# EAGLE design knob_spi (EAGLE 5.10)
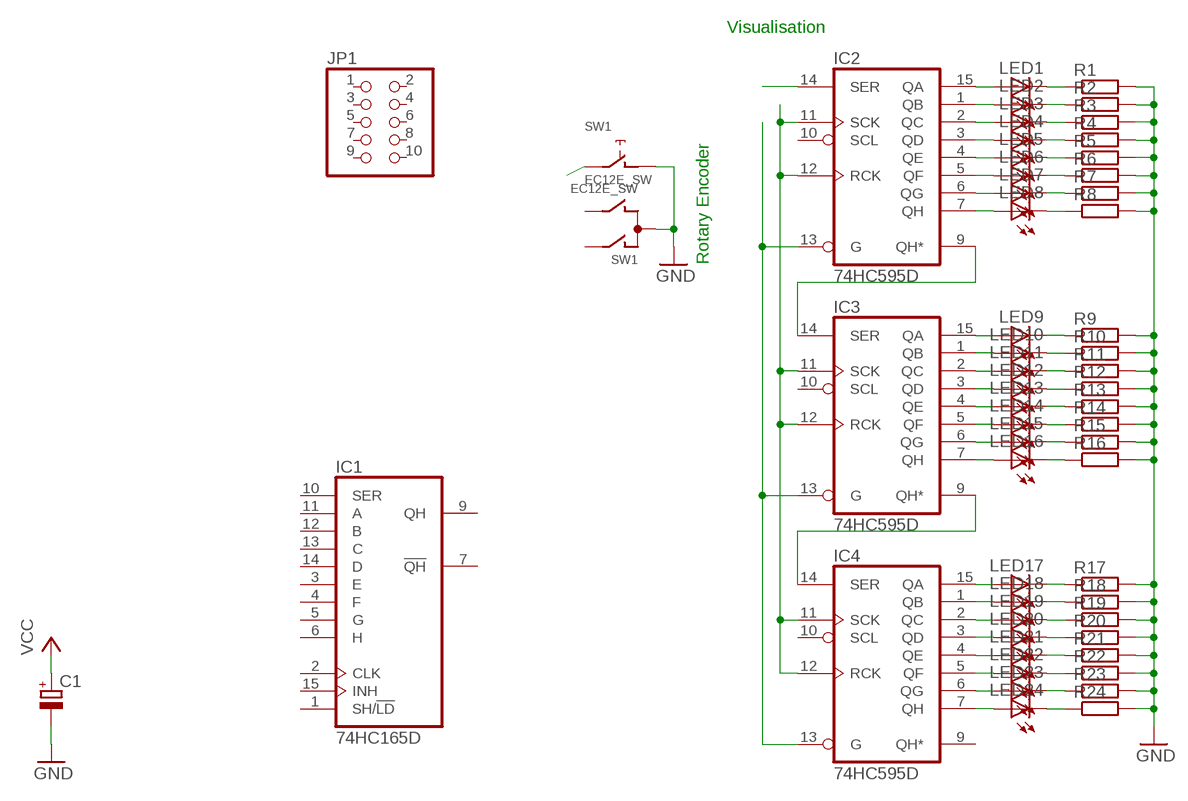
[diagram p0: schematic, sheet 1]

## Parts
C1  CPOL-EUE2.5-5  [E2,5-5]
IC1  74HC165D  [SO16]
IC2  74HC595D  [SO16]
IC3  74HC595D  [SO16]
IC4  74HC595D  [SO16]
JP1  PINHD-2X5  [2X05]
LED1  LED3MM  [LED3MM]
LED2  LED3MM  [LED3MM]
LED3  LED3MM  [LED3MM]
LED4  LED3MM  [LED3MM]
LED5  LED3MM  [LED3MM]
LED6  LED3MM  [LED3MM]
LED7  LED3MM  [LED3MM]
LED8  LED3MM  [LED3MM]
LED9  LED3MM  [LED3MM]
LED10  LED3MM  [LED3MM]
LED11  LED3MM  [LED3MM]
LED12  LED3MM  [LED3MM]
LED13  LED3MM  [LED3MM]
LED14  LED3MM  [LED3MM]
LED15  LED3MM  [LED3MM]
LED16  LED3MM  [LED3MM]
LED17  LED3MM  [LED3MM]
LED18  LED3MM  [LED3MM]
LED19  LED3MM  [LED3MM]
LED20  LED3MM  [LED3MM]
LED21  LED3MM  [LED3MM]
LED22  LED3MM  [LED3MM]
LED23  LED3MM  [LED3MM]
LED24  LED3MM  [LED3MM]
R1  R-EU_M0805  [M0805]
R2  R-EU_M0805  [M0805]
R3  R-EU_M0805  [M0805]
R4  R-EU_M0805  [M0805]
R5  R-EU_M0805  [M0805]
R6  R-EU_M0805  [M0805]
R7  R-EU_M0805  [M0805]
R8  R-EU_M0805  [M0805]
R9  R-EU_M0805  [M0805]
R10  R-EU_M0805  [M0805]
R11  R-EU_M0805  [M0805]
R12  R-EU_M0805  [M0805]
R13  R-EU_M0805  [M0805]
R14  R-EU_M0805  [M0805]
R15  R-EU_M0805  [M0805]
R16  R-EU_M0805  [M0805]
R17  R-EU_M0805  [M0805]
R18  R-EU_M0805  [M0805]
R19  R-EU_M0805  [M0805]
R20  R-EU_M0805  [M0805]
R21  R-EU_M0805  [M0805]
R22  R-EU_M0805  [M0805]
R23  R-EU_M0805  [M0805]
R24  R-EU_M0805  [M0805]
SW1  EC12E_SW  [ALPS_EC12E_SW]

## Nets
GND: C1.- R1.2 R2.2 R3.2 R4.2 R5.2 R6.2 R7.2 R8.2 R9.2 R10.2 R11.2 R12.2 R13.2 R14.2 R15.2 R16.2 R17.2 R18.2 R19.2 R20.2 R21.2 R22.2 R23.2 R24.2 SW1.C SW1.D
N$1: IC2.15(QA) LED1.A
N$2: IC2.1(QB) LED2.A
N$3: IC2.2(QC) LED3.A
N$4: IC2.3(QD) LED4.A
N$5: IC2.4(QE) LED5.A
N$6: IC2.5(QF) LED6.A
N$7: IC2.6(QG) LED7.A
N$8: IC2.9(QH*) IC3.14(SER)
N$9: IC3.15(QA) LED9.A
N$10: IC3.1(QB) LED10.A
N$11: IC3.2(QC) LED11.A
N$12: IC3.3(QD) LED12.A
N$13: IC3.4(QE) LED13.A
N$14: IC3.5(QF) LED14.A
N$15: IC3.6(QG) LED15.A
N$16: IC3.9(QH*) IC4.14(SER)
N$17: IC4.15(QA) LED17.A
N$18: IC4.1(QB) LED18.A
N$19: IC4.2(QC) LED19.A
N$20: IC4.3(QD) LED20.A
N$21: IC4.4(QE) LED21.A
N$22: IC4.5(QF) LED22.A
N$23: IC4.6(QG) LED23.A
N$24: IC4.7(QH) LED24.A
N$25: LED24.K(C) R24.1
N$26: LED23.K(C) R23.1
N$27: LED22.K(C) R22.1
N$28: LED21.K(C) R21.1
N$29: LED20.K(C) R20.1
N$30: LED19.K(C) R19.1
N$31: LED18.K(C) R18.1
N$32: LED17.K(C) R17.1
N$33: LED16.K(C) R16.1
N$34: LED15.K(C) R15.1
N$35: LED14.K(C) R14.1
N$36: LED13.K(C) R13.1
N$37: LED12.K(C) R12.1
N$38: LED11.K(C) R11.1
N$39: LED10.K(C) R10.1
N$40: LED9.K(C) R9.1
N$41: LED8.K(C) R8.1
N$42: LED7.K(C) R7.1
N$43: LED6.K(C) R6.1
N$44: LED5.K(C) R5.1
N$45: LED4.K(C) R4.1
N$46: LED3.K(C) R3.1
N$47: LED2.K(C) R2.1
N$48: LED1.K(C) R1.1
N$49: IC2.13(G) IC3.13(G) IC4.13(G)
N$50: IC2.14(SER)
N$51: IC2.7(QH) LED8.A
N$52: IC2.11(SCK) IC2.12(RCK) IC3.11(SCK) IC3.12(RCK) IC4.11(SCK) IC4.12(RCK)
N$53: SW1.E
N$56: IC3.7(QH) LED16.A
VCC: C1.+
Unconnected: IC1.1(SH/!LD) IC1.2(CLK) IC1.3(E) IC1.4(F) IC1.5(G) IC1.6(H) IC1.7(!QH) IC1.9(QH) IC1.10(SER) IC1.11(A) IC1.12(B) IC1.13(C) IC1.14(D) IC1.15(INH) IC2.10(SCL) IC3.10(SCL) IC4.9(QH*) IC4.10(SCL) JP1.1 JP1.2 JP1.3 JP1.4 JP1.5 JP1.6 JP1.7 JP1.8 JP1.9 JP1.10 SW1.A SW1.B SW1.GND1(G) SW1.GND2(G)

## Notes on the sheet
- Visualisation
- Rotary Encoder

## Power pins joined to a net without a drawn wire
GND: IC1.8(GND) IC2.8(GND) IC3.8(GND) IC4.8(GND)
VCC: IC1.16(VCC) IC2.16(VCC) IC3.16(VCC) IC4.16(VCC)

## Library data of the parts
C1 = resistor:CPOL-EU: POLARIZED CAPACITOR, European symbol
IC1 = 74xx-eu:74*165: 8-bit parallel load SHIFT REGISTER
IC2-IC4 = 74xx-eu:74*595: 8-bit SHIFT REGISTER, output latch
JP1 = pinhead:PINHD-2X5: PIN HEADER
LED1-LED24 = led:LED: LED OSRAM: - CHIPLED LG R971, LG N971, LY N971, LG Q971, LY Q971, LO R971, LY R971 LH N974, LH R974 LS Q976, LO Q976, LY Q976 LO Q996 - Hyper CHIPLED LW Q18S LB Q993, LB Q99A, LB R99A - SideLED LS A670, LO A670, LY A670, LG A670, LP A670 LB A673, LV A673, LT A673, LW A673 LH A674 LY A675 LS A676, LA A676, LO A676, LY A676, LW A676 LS A679, LY A679, LG A679 - Hyper Micro SIDELED® LS Y876, LA Y876, LO Y876, LY Y876 LT Y87S - SmartLED LW L88C, LW L88S LB L89C, LB L89S, LG L890 LS L89K, LO L89K, LY L89K LS L896, LA L896, LO L896, LY L896 - TOPLED LS T670, LO T670, LY T670, LG T670, LP T670 LSG T670, LSP T670, LSY T670, LOP T670, LYG T670 LG T671, LOG T671, LSG T671 LB T673, LV T673, LT T673, LW T673 LH T674 LS T676, LA T676, LO T676, LY T676, LB T676, LH T676, LSB T676, LW T676 LB T67C, LV T67C, LT T67C, LS T67K, LO T67K, LY T67K, LW E67C LS E67B, LA E67B, LO E67B, LY E67B, LB E67C, LV E67C, LT E67C LW T67C LS T679, LY T679, LG T679 LS T770, LO T770, LY T770, LG T770, LP T770 LB T773, LV T773, LT T773, LW T773 LH T774 LS E675, LA E675, LY E675, LS T675 LS T776, LA T776, LO T776, LY T776, LB T776 LHGB T686 LT T68C, LB T68C - Hyper Mini TOPLED® LB M676 - Mini TOPLED Santana® LG M470 LS M47K, LO M47K, LY M47K Source: http://www.osram.convergy.de LUXEON: - LUMILED® LXK2-PW12-R00, LXK2-PW12-S00, LXK2-PW14-U00, LXK2-PW14-V00 LXK2-PM12-R00, LXK2-PM12-S00, LXK2-PM14-U00 LXK2-PE12-Q00, LXK2-PE12-R00, LXK2-PE12-S00, LXK2-PE14-T00, LXK2-PE14-U00 LXK2-PB12-K00, LXK2-PB12-L00, LXK2-PB12-M00, LXK2-PB14-N00, LXK2-PB14-P00, LXK2-PB14-Q00 LXK2-PR12-L00, LXK2-PR12-M00, LXK2-PR14-Q00, LXK2-PR14-R00 LXK2-PD12-Q00, LXK2-PD12-R00, LXK2-PD12-S00 LXK2-PH12-R00, LXK2-PH12-S00 LXK2-PL12-P00, LXK2-PL12-Q00, LXK2-PL12-R00 Source: www.luxeon.com KINGBRIGHT: KA-3528ASYC Source: www.kingbright.com
R1-R24 = resistor:R-EU_: RESISTOR, European symbol
SW1 = switch-alps:EC12E_SW: ALPS rotary Encoder EC12E series with switch

## Board
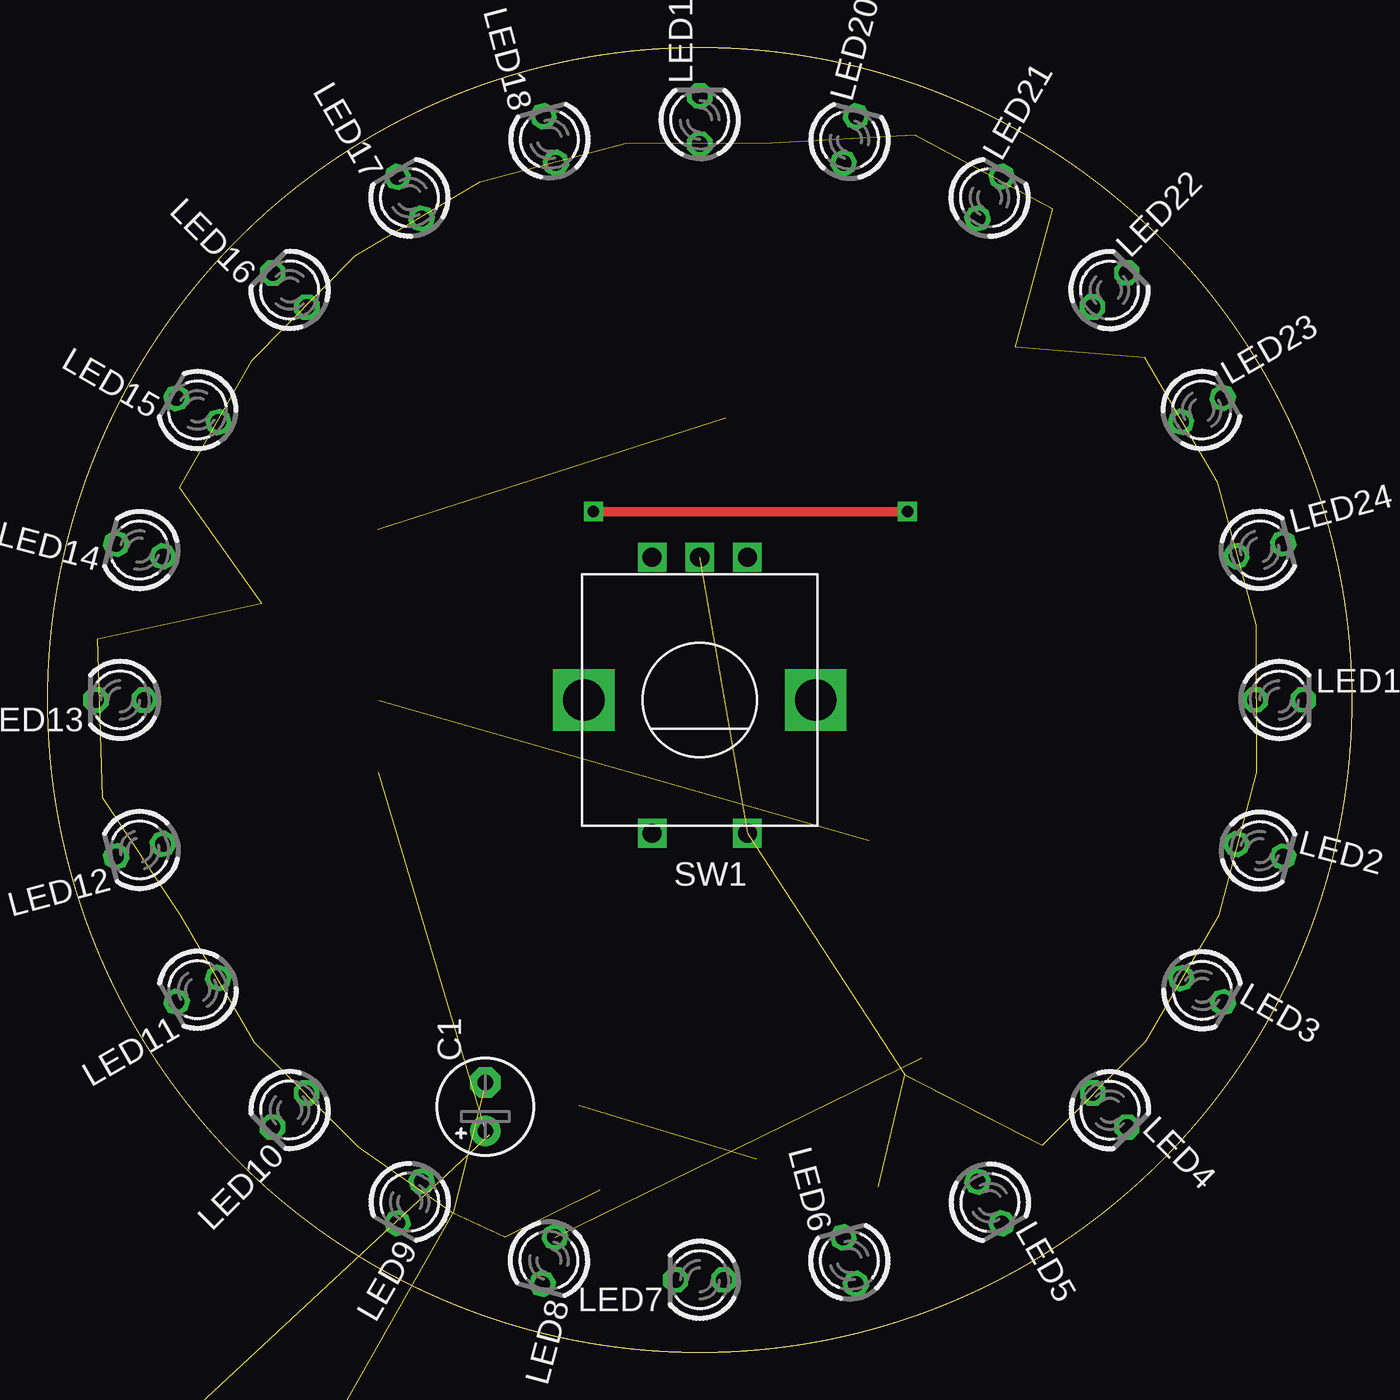
[diagram p1: board, top side]
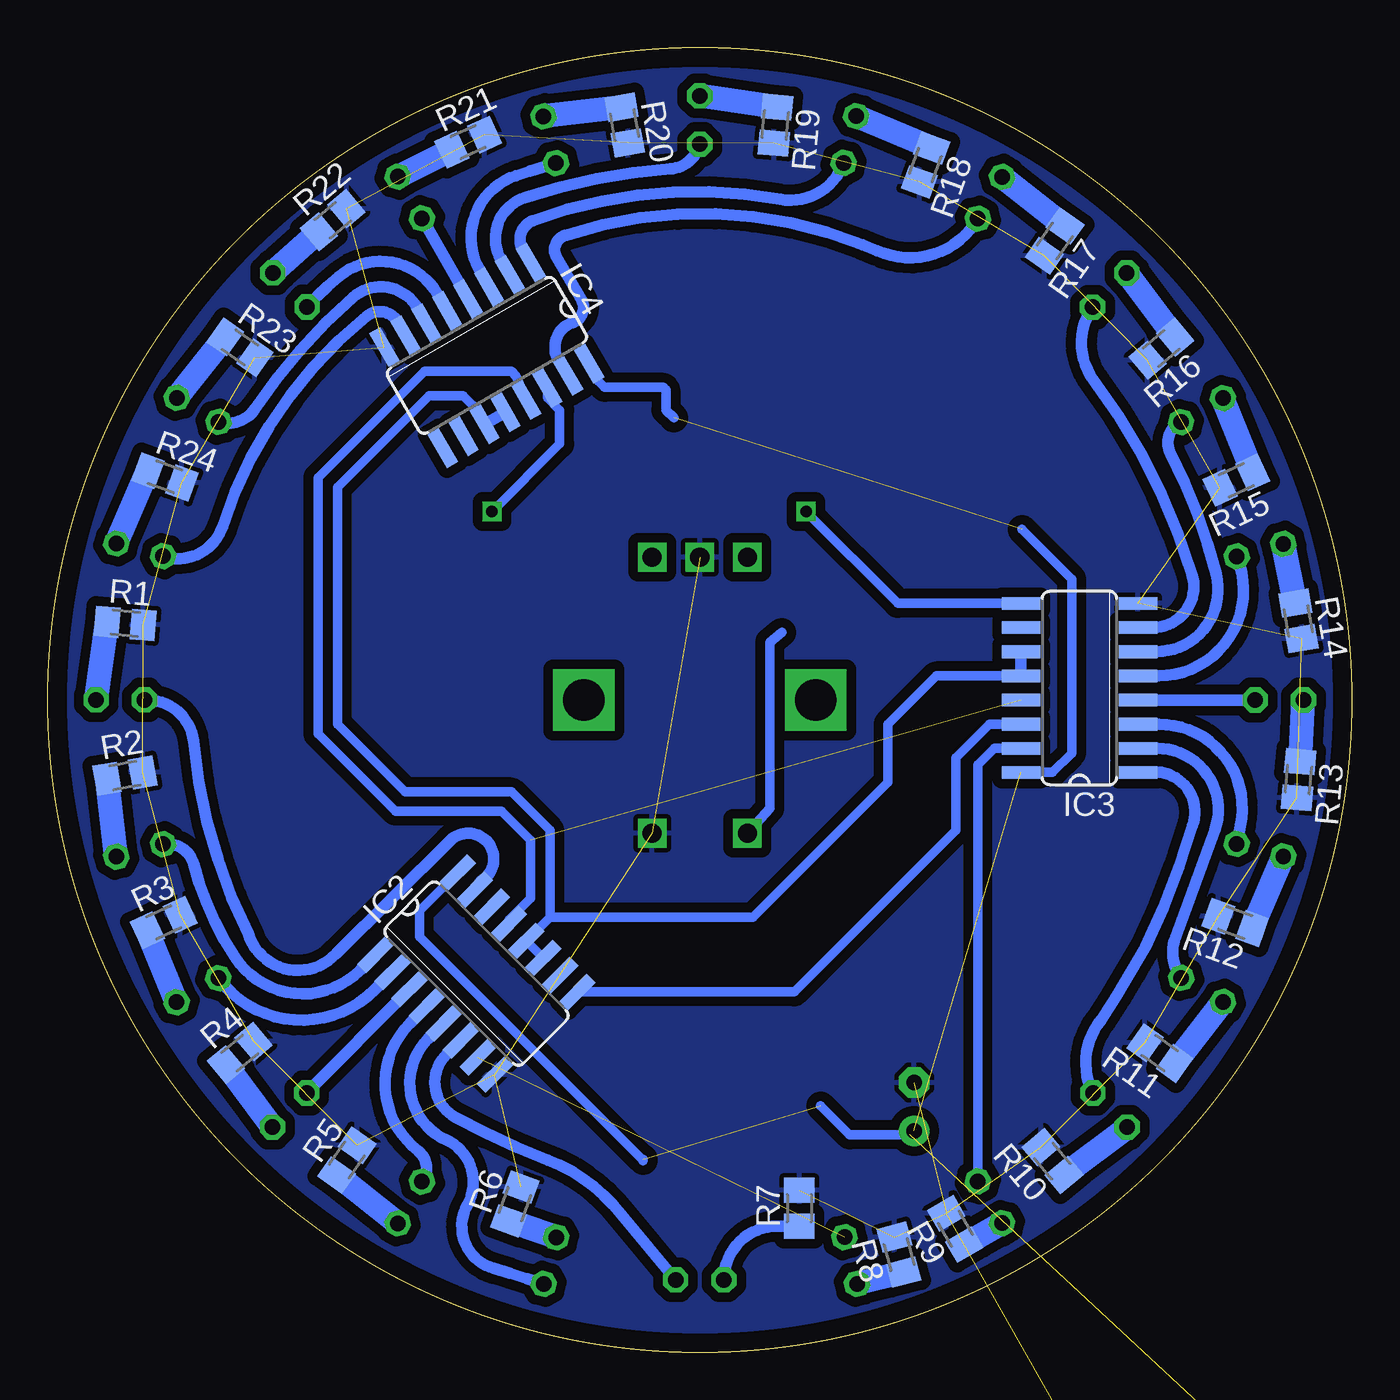
[diagram p2: board, bottom side, seen from below]

Size 68.58 x 68.58 mm. Coordinates in mm from the lower left corner, seen from the top.
Outline: circle at 34.29,34.29 radius 34.29
Copper layers (1*16): Top 0.035mm / dielectric 1.5mm / Bottom 0.035mm
Design rules "default *": minimum track width 10mil, minimum drill 24mil, track to track 20mil, track to pad 16mil, pad to pad 16mil, via to via 16mil, smd to smd 8mil, copper to edge 40mil, drill to drill 8mil, minimum pad ring 10mil, minimum via ring 8mil, stop-mask expansion 4mil, vias tented up to drill 0mil, thermal gap 10mil

### Footprints (pad centres in the part's own frame; a part is rotated, then mirrored left to right if it is on the bottom)
E2,5-5 = drill 0.813 pad 1.6 round: + -1.27,0 | drill 0.813 pad 1.6 octagon: - 1.27,0
SO16 = smd 0.66 x 2.032: 1 -4.445,-3.073; 2 -3.175,-3.073; 3 -1.905,-3.073; 4 -0.635,-3.073; 5 0.635,-3.073; 6 1.905,-3.073; 7 3.175,-3.073; 8 4.445,-3.073; 9 4.445,3.073; 10 3.175,3.073; 11 1.905,3.073; 12 0.635,3.073; 13 -0.635,3.073; 14 -1.905,3.073; 15 -3.175,3.073; 16 -4.445,3.073
2X05 = drill 1.016 octagon: 1 -5.08,-1.27; 2 -5.08,1.27; 3 -2.54,-1.27; 4 -2.54,1.27; 5 0,-1.27; 6 0,1.27; 7 2.54,-1.27; 8 2.54,1.27; 9 5.08,-1.27; 10 5.08,1.27
LED3MM = drill 0.813 octagon: A -1.27,0; K 1.27,0
M0805 = smd 1.3 x 1.6: 1 -0.95,0; 2 0.95,0
ALPS_EC12E_SW = drill 1 square: A -2.5,-7.5; B 2.5,-7.5; C 0,-7.5; D -2.5,7; E 2.5,7 | drill 2.2 square: GND1 -6.1,0; GND2 6.1,0

### Placement (x,y rotation side)
C1  23.02,12.91 90 top
IC1  2.41,-15.11 0 top  (outside the outline)
IC2  46.04,19.91 315 bottom
IC3  14.32,34.92 90 bottom
IC4  45.49,52.4 210 bottom
JP1  2.54,-7.49 0 top  (outside the outline)
LED1  64.76,34.3 0 top
LED2  63.74,26.38 345 top
LED3  60.7,19.04 330 top
LED4  55.85,12.74 315 top
LED5  49.53,7.88 300 top
LED6  42.16,4.83 105 top
LED7  34.29,3.81 180 top
LED8  26.35,4.84 255 top
LED9  19.03,7.89 240 top
LED10  12.72,12.74 225 top
LED11  7.88,19.05 210 top
LED12  4.84,26.4 195 top
LED13  3.82,34.29 180 top
LED14  4.84,42.16 165 top
LED15  7.88,49.53 150 top
LED16  12.74,55.84 135 top
LED17  19.03,60.69 120 top
LED18  26.4,63.75 105 top
LED19  34.29,64.77 90 top
LED20  42.18,63.73 75 top
LED21  49.53,60.7 60 top
LED22  55.84,55.84 45 top
LED23  60.69,49.54 30 top
LED24  63.73,42.19 15 top
R1  64.49,38.32 355 bottom
R2  64.52,30.32 10 bottom
R3  62.47,22.6 25 bottom
R4  58.47,15.74 40 bottom
R5  52.84,10.11 55 bottom
R6  44.02,7.8 70 bottom
R7  29.05,7.58 90 bottom
R8  23.82,5.14 105 bottom
R9  20.86,6.49 120 bottom
R10  15.74,10.06 130 bottom
R11  10.1,15.73 145 bottom
R12  6.14,22.61 160 bottom
R13  2.81,30.1 265 bottom
R14  2.81,38.45 280 bottom
R15  6.08,45.85 205 bottom
R16  10.02,52.75 220 bottom
R17  15.63,58.42 235 bottom
R18  22.42,62.41 250 bottom
R19  30.31,64.5 265 bottom
R20  38.24,64.5 280 bottom
R21  46.46,63.61 25 bottom
R22  53.59,59.51 40 bottom
R23  58.46,52.83 325 bottom
R24  62.41,46.02 340 bottom
SW1  34.29,34.29 180 top

### Tracks (layer width: path | path; a pad name or v marks a point on that pad's centre or on a via)
GND  (30 unrouted)
  pour Bottom: 0,34.29 arc-90 34.29,68.58 arc-90 68.58,34.29 arc-90 34.29,0 arc-90
N$1
  Bottom 0.61: LED1.A 63.27,34.29 arc82 60.91,32.13 arc-21 58.01,21.97 arc-119 53.42,20.95 47.42,26.9 arc195 45.8,24.77 IC2.15
N$2
  Bottom 0.61: IC2.1 52.15,20.09 arc102 58.73,20.78 arc18 60.91,25.68 arc-85 LED2.A
N$3
  Bottom 0.61: IC2.2 51.36,19.07 arc99 LED3.A
N$4
  Bottom 0.61: IC2.3 LED4.A
N$5
  Bottom 0.61: IC2.4 49.55,17.27 arc-96 49.1,10.59 arc90 LED5.A
N$6
  Bottom 0.61: IC2.5 48.59,16.46 arc-110 47.62,11.18 arc95 46.51,7.77 arc-103 45.14,4.42 arc2 LED6.A
N$7
  Bottom 0.61: IC2.6 47.6,15.67 arc-107 47.14,12.37 arc-8 42.27,10.11 arc31 38.4,7.24 LED7.A
N$8
  Bottom 0.508: IC3.14 19.05,33.02 20.83,31.24 20.83,27.43 29.31,18.95 IC2.9
N$9
  Bottom 0.508: IC3.15 18.8,31.75 19.67,30.88 LED9.A
N$10
  Bottom 0.61: IC3.1 10.44,30.5 arc112 8.38,27.69 arc10 10.87,21.28 arc3 13.18,17.48 arc-67 LED10.A
N$11
  Bottom 0.61: IC3.2 10.26,31.75 arc110 7.21,27.46 arc1 9.27,21.84 arc-57 LED11.A
N$12
  Bottom 0.61: IC3.3 10.18,33.02 arc102 5.87,27.69 arc-1 LED12.A
N$13
  Bottom 0.61: LED13.A IC3.4
N$14
  Bottom 0.61: IC3.5 10.18,35.56 arc-113 LED14.A
N$15
  Bottom 0.61: IC3.6 10.29,36.83 arc-104 7.14,40.89 arc-13 9.55,47.27 arc93 LED15.A
N$16  (via drill 0.6)
  Top 0.508: v28.7,44.2 v45.21,44.2
  Bottom 0.508: IC3.9 23.88,39.37 v28.7,44.2 | v45.21,44.2 41.66,47.75 41.66,49.53 42.3,50.17 IC4.14
N$17
  Bottom 0.61: LED17.A 19.84,59.33 arc81 24.97,57.91 25.73,58.22 arc-40 41.3,58.73 arc-110 41.81,57.56 40.51,55.32 arc102 40.97,54.13 arc-104 41.71,52.12 arc-2 IC4.15
N$18
  Bottom 0.61: IC4.1 43.59,57.96 arc101 43.05,59.49 arc31 30.05,60.6 arc-81 LED18.A
N$19
  Bottom 0.61: IC4.2 44.73,57.43 arc102 43.51,60.68 arc15 35.84,62.2 arc-72 LED19.A
N$20
  Bottom 0.61: IC4.3 45.87,56.9 arc102 43.94,61.85 arc1 LED20.A
N$21
  Bottom 0.61: IC4.4 LED21.A
N$22
  Bottom 0.61: IC4.5 48.08,55.63 arc-100 53.26,56.54 arc-7 LED22.A
N$23
  Bottom 0.61: IC4.6 49.15,54.91 arc-101 52.53,55.45 arc-14 57.68,49.58 arc73 LED23.A
N$24
  Bottom 0.61: IC4.7 50.16,54.15 arc-99 51.82,54.46 arc-33 59.38,43.41 arc91 LED24.A
N$25
  Bottom 1.27: LED24.K R24.1
N$26
  Bottom 1.27: LED23.K R23.1
N$27
  Bottom 1.27: R22.1 LED22.K
N$28
  Bottom 1.27: R21.1 LED21.K
N$29
  Bottom 1.27: R20.1 LED20.K
N$30
  Bottom 1.27: R19.1 LED19.K
N$31
  Bottom 1.27: R18.1 LED18.K
N$32
  Bottom 1.27: R17.1 LED17.K
N$33
  Bottom 1.27: R16.1 LED16.K
N$34
  Bottom 1.27: R15.1 LED15.K
N$35
  Bottom 1.27: R14.1 LED14.K
N$36
  Bottom 1.27: R13.1 LED13.K
N$37
  Bottom 1.27: R12.1 LED12.K
N$38
  Bottom 1.27: R11.1 LED11.K
N$39
  Bottom 1.27: R10.1 LED10.K
N$40
  Bottom 1.27: LED9.K R9.1
N$41
  Bottom 1.27: R8.1 LED8.K
N$42
  Bottom 0.61: LED7.K 33.02,3.89 arc90 30.2,6.63 R7.1
N$43
  Bottom 1.27: LED6.K R6.1
N$44
  Bottom 1.27: LED5.K R5.1
N$45
  Bottom 1.27: LED4.K R4.1
N$46
  Bottom 1.27: LED3.K R3.1
N$47
  Bottom 1.27: LED2.K R2.1
N$48
  Bottom 1.27: LED1.K R1.1
N$49  (1 unrouted)
  Bottom 0.508: IC4.13 43.94,51.31 44.2,51.56 48.77,51.56 54.36,45.97 54.36,32.51 50.29,28.45 44.7,28.45 43.18,26.92 43.18,23.88 44.31,22.74 IC2.13
N$51  (1 unrouted)
  Bottom 0.508: IC2.7 45.97,15.5
N$52
  Bottom 0.508: 42.51,20.74 IC2.11 IC2.12 | IC4.11 46.23,49.78 46.74,50.29 48.51,50.29 53.34,45.47 53.34,33.02 49.78,29.46 44.2,29.46 42.16,27.43 42.16,22.86 | 42.16,22.86 43.38,21.64 IC2.12 | 42.16,22.86 31.5,22.86 24.38,29.97 24.38,33.02 21.85,35.56 IC3.12 | IC2.12
  Bottom 0.61: IC3.12 IC3.11 | IC4.11 IC4.12
N$53
  Bottom 0.508: 29.97,37.84 30.61,37.34 30.61,28.6 SW1.E
N$56
  Bottom 0.61: IC3.7 10.46,38.1 arc-107 8.41,40.89 arc-20 13.56,51.08 arc71 LED16.A
VCC  (4 unrouted)
  Bottom 0.508: IC4.16 39.62,51.05 39.29,50.72 36.2,50.72 36.07,50.59 36.07,49.53 35.66,49.12 | IC3.16 15.75,30.48 14.73,31.5 14.73,40.64 17.35,43.26 | C1.+ 23.23,11.43 26.42,11.43 27.94,12.95 | 37.27,10.07 37.27,10.16 37.34,10.16 49.02,21.84 49.02,23.21 IC2.16